# Altium schematic sheet Headers.SchDoc: Name project title here
size 297 x 209 mm; Organization: Krakul OÜ; Address1: Kaare tee 3, lubja; Address2: viimsi vald; Address3: harju maakond; Address4: Estonia 74010; DocumentNumber: No here; Revision: 0; SheetNumber: 5; SheetTotal: 5
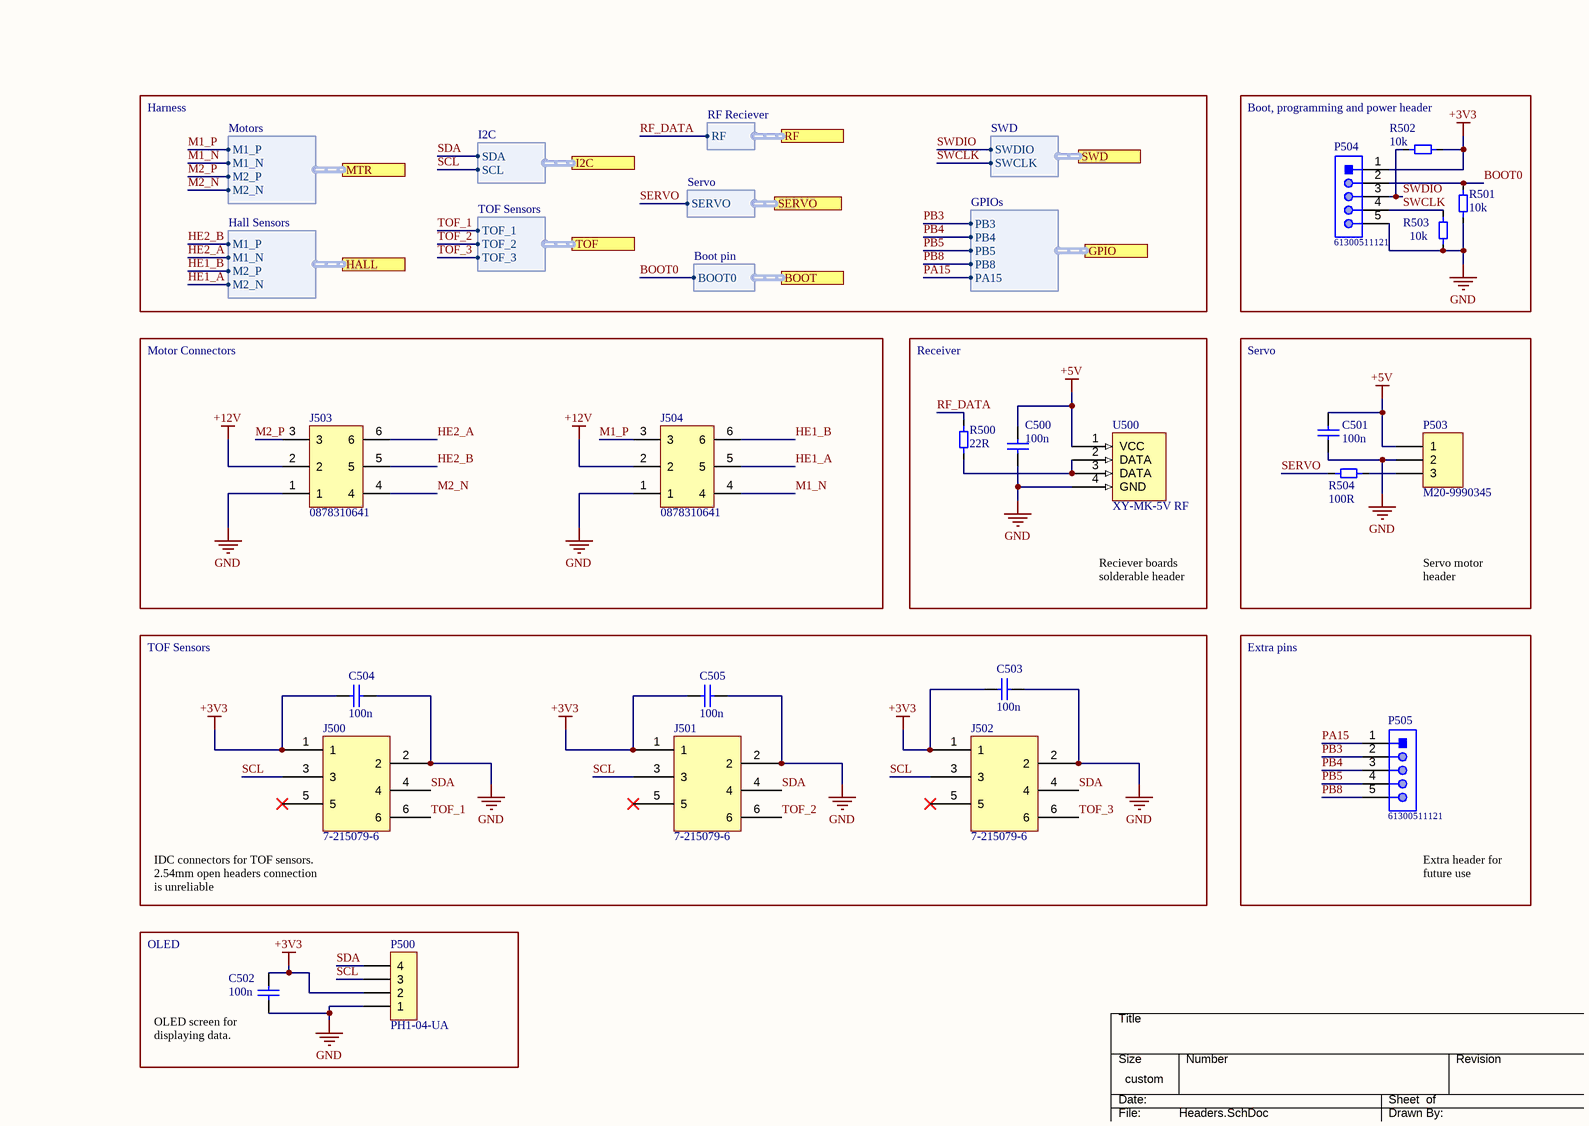
[diagram p0: Headers.SchDoc]

## Parts
C500  100n  [MLCC_0603_M]
C501  100n  [MLCC_0603_M]
C502  100n  [MLCC_0603_M]
C503  100n  [MLCC_0603_M]
C504  100n  [MLCC_0603_M]
C505  100n  [MLCC_0603_M]
J500  7-215079-6  [7-215079-6-Footprint-1]
J501  7-215079-6  [7-215079-6-Footprint-1]
J502  7-215079-6  [7-215079-6-Footprint-1]
J503  0878310641  [0878310641]
J504  0878310641  [0878310641]
P500  PH1-04-UA  [4Pos Pin Header Vertical]
P503  M20-9990345  [3Pos Pin Header]
P504  61300511121  [61300511121]
P505  61300511121  [61300511121]
R500  22R  [Resistor_0603_M]
R501  10k  [Resistor_0603_M]
R502  10k  [Resistor_0603_M]
R503  10k  [Resistor_0603_M]
R504  100R  [Resistor_0603_M]
U500  XY-MK-5V RF  [2.54mm 4 POS XY-MK-5V RF]

## Blocks framed on the sheet
Boot, programming and power header: P504 R501-R503
Motor Connectors: J503 J504
Receiver: C500 R500 U500
Servo: C501 P503 R504
TOF Sensors: C503-C505 J500-J502
Extra pins: P505
OLED: C502 P500

## Ports
BOOT (harness Boot pin, see Overview[3C], MCU_USB[3A]), GPIO (harness GPIOs, see Overview[3C], MCU_USB[2B]), HALL (harness Hall Sensors, see Overview[3C], MCU_USB[2B]), I2C (harness I2C, see Overview[3C], MCU_USB[3A]), MTR (harness Motors, see Overview[3B], Driver[6A]), RF (harness RF Reciever, see Overview[3C], MCU_USB[3B]), SERVO (harness Servo, see Overview[3C], MCU_USB[3B]), SWD (harness SWD, see Overview[3C], MCU_USB[3B]), TOF (harness TOF Sensors, see Overview[3C], MCU_USB[3B])

## Harnesses
Motors: M1_P, M1_N, M2_P, M2_N
Hall Sensors: M1_P, M1_N, M2_P, M2_N
I2C: SDA, SCL
TOF Sensors: TOF_1, TOF_2, TOF_3
RF Reciever: RF
Boot pin: BOOT0
SWD: SWDIO, SWCLK
Servo: SERVO
GPIOs: PB4, PB5, PB8, PA15, PB3

## Nets
+3V3: C502.1 C503.1 C504.1 C505.1 J500.1 J501.1 J502.1 P500.2 P504.1 R502.1
+5V: C500.1 C501.1 P503.1 U500.1(VCC)
+12V: J503.2 J504.2
GND: C500.2 C501.2 C502.2 C503.2 C504.2 C505.2 J500.2 J501.2 J502.2 J503.1 J504.1 P500.1 P503.2 P504.5 R501.1 R503.1 U500.4(GND)
BOOT0: P504.2 R501.2 ; port BOOT.BOOT0
HE1_A: J504.5 ; port HALL.M2_N
HE1_B: J504.6 ; port HALL.M2_P
HE2_A: J503.6 ; port HALL.M1_N
HE2_B: J503.5 ; port HALL.M1_P
M1_N: J504.4 ; port MTR.M1_N
M1_P: J504.3 ; port MTR.M1_P
M2_N: J503.4 ; port MTR.M2_N
M2_P: J503.3 ; port MTR.M2_P
PA15: P505.1 ; port GPIO.PA15
PB3: P505.2 ; port GPIO.PB3
PB4: P505.3 ; port GPIO.PB4
PB5: P505.4 ; port GPIO.PB5
PB8: P505.5 ; port GPIO.PB8
RF_DATA: R500.1 ; port RF.RF
SCL: J500.3 J501.3 J502.3 P500.3 ; port I2C.SCL
SDA: J500.4 J501.4 J502.4 P500.4 ; port I2C.SDA
SERVO: R504.2 ; port SERVO.SERVO
SWCLK: P504.4 R503.2 ; port SWD.SWCLK
SWDIO: P504.3 R502.2 ; port SWD.SWDIO
TOF_1: J500.6 ; port TOF.TOF_1
TOF_2: J501.6 ; port TOF.TOF_2
TOF_3: J502.6 ; port TOF.TOF_3
NetP503_3: P503.3 R504.1
NetR500_2: R500.2 U500.2(DATA) U500.3(DATA)

Not connected (* = marked no-connect by the designer): J500 5*; J501 5*; J502 5*

## Notes on the sheet
- Harness
- Reciever boards solderable header
- Servo motor header
- (near J500) IDC connectors for TOF sensors. 2.54mm open headers connection is unreliable
- Extra header for future use
- (near C502) OLED screen for displaying data.
- Title:
- Date:
- Last modified:
- Project:
- Sheet
- Time:
- of
- Size:
- A3
- Engineer:
- Revision:
- Revision date:
- Checked by:

## Library data of the parts
C500-C505 = CMP-001-0815-1: MLCC, 0603, 100n, 10%, 50V, X7R; Manufacturer: Any; Value: 100nF; Capacitor Type: Ceramic; Part number: MLCC, 0603, 100n, 10%, 50V, X7R; RoHS: Yes; Dielectric: X7R; Mount: SMD; Voltage: 50V; Tolerance: 10%; Case/Package: 0603
J500-J502 = CMP-ROOT-01311-2: Conn FFC Connector F 6 POS 1.27mm Solder ST Thru-Hole Automotive Box/Carton; Manufacturer: TE Connectivity; Manufacturer Lifecycle Status: ACTIVE; Contact Current Rating: 1A; Contact Resistance: 10mΩ; Insulation Resistance: 1GΩ; Mating Connector Lock: Without; Number of Contacts: 6; Number of Ports: 1; Operating Force: 4.8928N; Operating Supply Voltage: 100V; PCB Mount Retention: With; Plating Thickness: 4.99999µm; Row Spacing: 2.54mm; Shielding: No; Mount: TH; Part number: 7-215079-6; Pins: 6; RoHS: Compliant; China RoHS: Compliant; Color: Red; Contact Gender: Female; Contact Material: Nickel, Tin; Contact Plating: Tin; Current Rating: 1A; Height: 4.2mm; Housing Color: Red; Insulation Material: Thermoplastic; Lead Free: Lead Free; Lead Pitch: 1.27mm; Length: 9.7mm; Lifecycle Status: Production; Max Operating Temperature: 105°C; Min Operating Temperature: -40°C; Mounting Technology: Through Hole; Number of Positions: 6; Number of Rows: 2; Orientation: Vertical; Packaging: Box; REACH SVHC: Yes; Terminal Pitch: 1.27mm; Voltage Rating: 100V; Voltage Rating (DC): 100V
J503 J504 = CMP-ROOT-01318-3: Conn Shrouded Header (2 Sides) HDR 6 POS 2mm Solder ST Top Entry Thru-Hole Milli-Grid Tube; Manufacturer: Molex; Manufacturer Lifecycle Status: ACTIVE; Current Rating: 2A; Dielectric Material: Polyamide; Insulation Resistance: 1GΩ; Number of Circuits: 6; Operating Force: 1.9N; Plating: Tin; Plating Thickness: 762nm; Mount: TH; Part number: 0878310641; Pins: 6; RoHS: Compliant; China RoHS: Compliant; Contact Gender: Male; Contact Plating: Gold; Export Control Classification Number (ECCN) Code: EAR99; Harmonized Tariff Schedule (HTS) Code: 8536.69.40.40; Introduction Date: 2014-01-28; Lifecycle Status: Production; Max Operating Temperature: 105°C; Min Operating Temperature: -55°C; Number of Rows: 2; Orientation: Vertical; REACH SVHC: Yes; Row Spacing: 2mm; Schedule B: 8536694040, 8536694040; Terminal Pitch: 2mm
P500 = CMP-002-000004-1: 4 POS 2.54mm Vertical THT Header; Manufacturer: Adam Tech; Number of Positions: 4; Pins: 4; RoHS: Yes; Part number: PH1-04-UA; Mount: TH; Lead Free: Lead Free; Pitch: 2.54mm; Termination: Through Hole
P503 = CMP-ROOT-00217-1: Connector Header Through Hole 3 position 0.100" (2.54mm); Manufacturer: Harwin Inc.; Insulation Resistance: 10GR; Number of Positions: 3; Voltage Rating (AC): 750V; Max Current Rating: 3A; Contact Resistance: 25mR; Connector Type: Male Pin; Min Operating Temperature: -40°C; Contact Material: Brass,Bronze; Package Quantity: 1000; Housing Material: Nylon; Contact Plating: Gold; Contact Mating Length: 0.24inch; Pitch: 2.54mm; Number of Rows: 1; REACH SVHC: No SVHC; Packaging: Bulk; Housing Color: Black; Width: 0.25inch; Number of Contacts: 3; Pins: 3; Mount: Through Hole; Radiation Hardening: No; RoHS: Yes; Weight: 0.006138oz; Depth: 2.54mm; Color: Black; Part number: M20-9990345; Case/Package: SIL; Termination: Solder; Max Operating Temperature: 105°C; Current Rating: 3A; Length: 7.62mm; Height: 0.125inch; Orientation: Straight
P504 P505 = CMP-ROOT-01020-1: Conn Unshrouded Header HDR 5 POS 2.54mm Solder ST Top Entry Thru-Hole Bag; Manufacturer: Wurth; Mount: TH; Part number: 61300511121; RoHS: Yes
R500 = CMP-001-0038-3: Resistor, 0603, 22R, 1%, 1/10W; Manufacturer: Any; Value: 22; Power: 100mW; Part number: Resistor, 0603, 22R, 1%, 1/10W; Tolerance: 1%; Case/Package: 0603; Mount: SMD; RoHS: Yes
R501 = CMP-0001-00257-1: Resistor, 0603, 10k, ≤5%, ≥1/16W; Manufacturer: Any; Case/Package: 0603; Mount: SMD; Part number: Resistor, 0603, 10k, ≤5%, ≥1/16W; RoHS: Yes; Value: 10k
R502 R503 = CMP-001-0101-2: Resistor, 0603, 10k, 1%, 1/10W; Manufacturer: Any; Power: 100mW; Tolerance: 1%; Value: 10k; RoHS: Yes; Mount: SMD; Case/Package: 0603; Part number: Resistor, 0603, 10k, 1%, 1/10W
R504 = CMP-001-0054-5: Resistor, 0603, 100R, 1%, 1/10W; Manufacturer: Any; Value: 100; Power: 100mW; Case/Package: 0603; Mount: SMD; Part number: Resistor, 0603, 100R, 1%, 1/10W; Tolerance: 1%; RoHS: Yes
U500 = CMP-00015-1: 433MHz reciever module, 5V tolerant; Manufacturer: Unknown; Case/Package: 2.54mm 4 POS; Mount: THT; Part number: XY-MK-5V RF; RoHS: Yes